# Altium schematic sheet Accelerometer 3-AXIS - BMA180.SchDoc
size A4; Organization: Altium Limited; Address1: 3 Minna Close; Address2: Belrose; Address3: NSW 2085; Address4: Australia
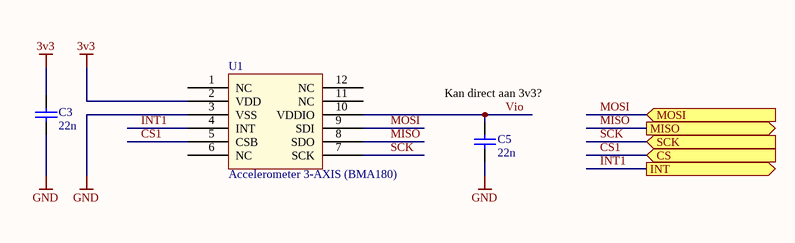
[diagram p0: Accelerometer 3-AXIS - BMA180.SchDoc]

## Parts
C3  22n  [C0805]
C5  22n  [C0805]
U1  Accelerometer 3-AXIS (BMA180)  [BMA180]

## Ports
CS (in), INT (out), MISO (out), MOSI (in), SCK (in)

## Nets
3v3: C3.2 U1.2(VDD)
GND: C3.1 C5.1 U1.3(VSS)
CS1: U1.5(CSB) ; port CS
INT1: U1.4(INT) ; port INT
MISO: U1.8(SDO) ; port MISO
MOSI: U1.9(SDI) ; port MOSI
SCK: U1.7(SCK) ; port SCK
Vio: C5.2 U1.10(VDDIO)

Not connected (* = marked no-connect by the designer): U1 1(NC) 6(NC) 11(NC) 12(NC)

## Notes on the sheet
- (near C5) Kan direct aan 3v3?
- Title
- Size:
- Date:
- A4
- Name:
- Time:
- Ing. W. Pietersz
- Revision:
- Sheet
- of
- WillyPietersz@gmail.com
- Contact:
- info@unique-system.nl
- Unique System Elektronics
- Biesboschhaven noord 1-b
- 4251 NL Werkendam
- Netherlands
- www.unique-system.nl
- File:

## Library data of the parts
C3 C5 = 22n: Tolerance: 0.1; LatestRevision Note: Initial Release; Part Number: 22n; Value: 22n; Package: 0805; Component Type: Standard; LatestRevision Date: 31-7-2010; Author: Willy Pietersz; ComponentLink1Description: Manufacturer; ComponentLink2Description: Datasheet
U1 = BMA180: Part Number: BMA180; Component Type: Sensor; Supplier 1: Digikey; Supplier Part Number 1: 828-1019-1-ND; ComponentLink1Description: Datasheet; ComponentLink1URL: http://www.bosch-sensortec.com/content/language1/downloads/BST-BMA180-FL000-03.pdf